# Altium schematic sheet FPGA_B14_B16.SchDoc: TE0722
size A4; Organization: Trenz Electronic GmbH; DocumentNumber: 3; Revision: 01; SheetNumber: 3; SheetTotal: 8; Date: 07.11.2014; PageSetup: Record=PageOptions|CenterHorizontal=True|CenterVertical=True|PrintScale=0.96|XCorrection=1.00|YCorrection=1.00|PrintKind=0|BorderSize=5000000|LeftOffset=0|BottomOffset=0|Orientation=2|PaperLength=1000|PaperWidth=1000|Scale=100|PaperSource=7|PrintQuality=-4|MediaType=1|DitherType=10|PaperKind=A4|PrintScaleMode=1
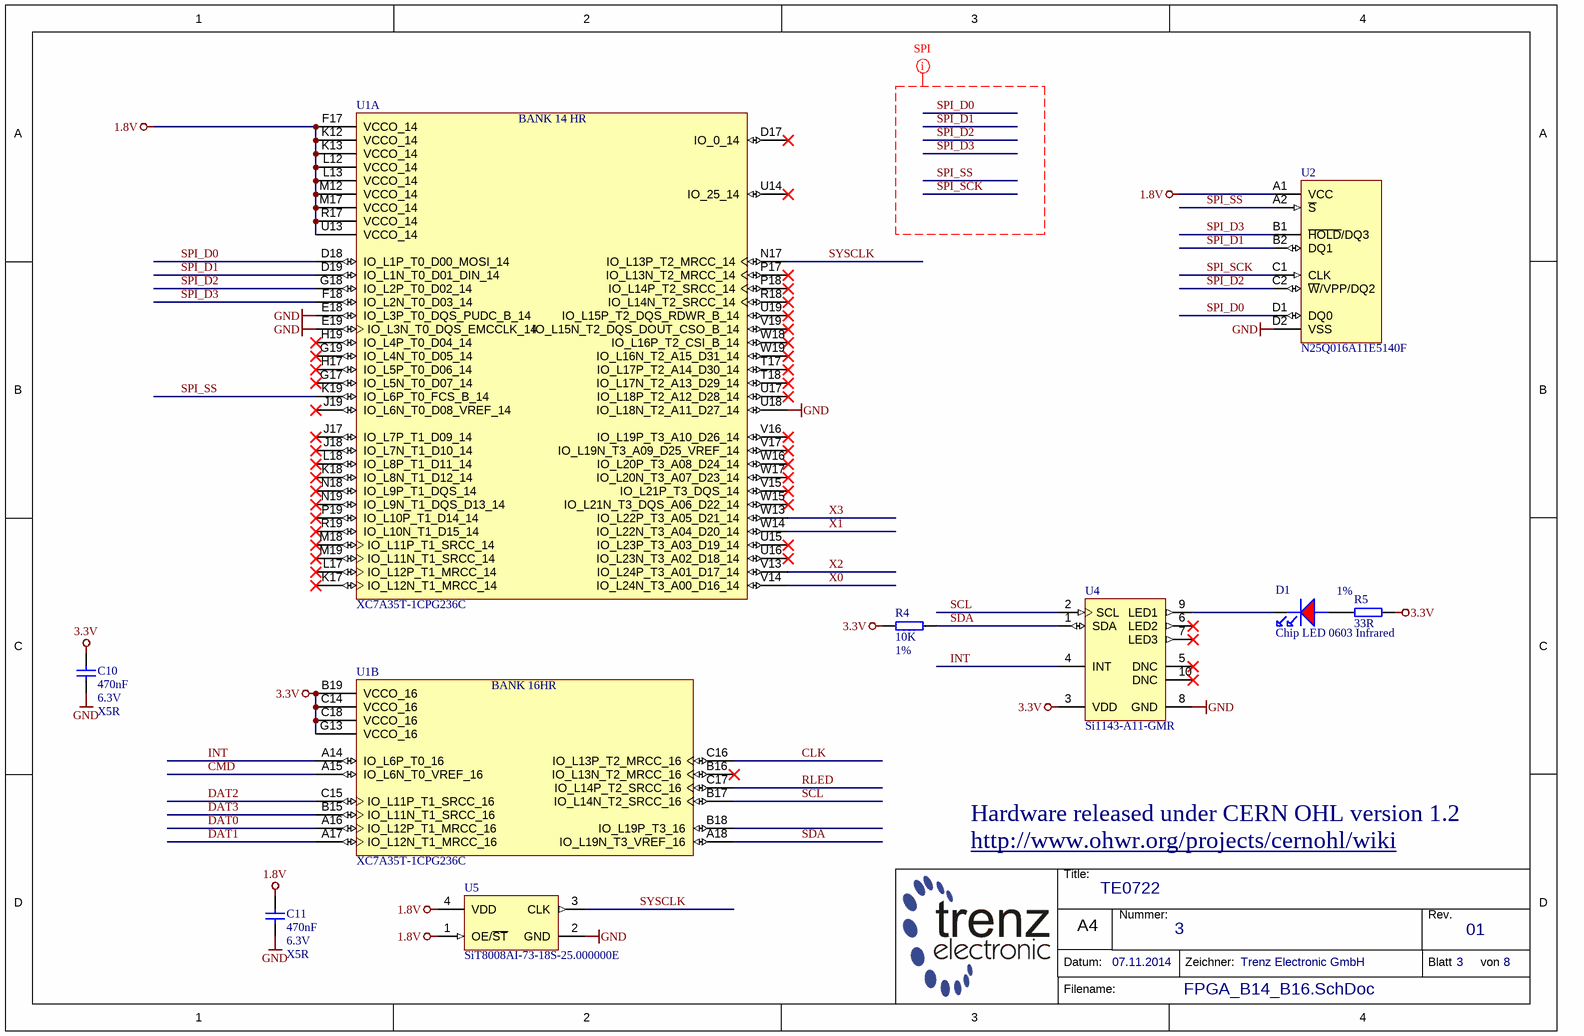
[diagram p0: FPGA_B14_B16.SchDoc]

## Parts
C10  470nF  Voltage: 6.3V  Technology: X5R  [CAPC0603X33N]
C11  470nF  Voltage: 6.3V  Technology: X5R  [CAPC0603X33N]
D1  Chip LED 0603 Infrared  [chipLED_0603_Red]
R4  10K  Tolerance: 1%  [RESC0603X26N]
R5  33R  Tolerance: 1%  [RESC1005X40N]
U1  XC7A35T-1CPG236C  [XC7AxxT-CPG236]  (parts A,B of 8)
U2  N25Q016A11E5140F  [BGA8C50P4X2_271X196X41B30N]
U4  Si1143-A11-GMR  [QFN50P200X200X75-10N]
U5  SiT8008AI-73-18S-25.000000E  [2016]

## Nets
1.8V: C11.1 U1.F17(VCCO_14) U1.K12(VCCO_14) U1.K13(VCCO_14) U1.L12(VCCO_14) U1.L13(VCCO_14) U1.M12(VCCO_14) U1.M17(VCCO_14) U1.R17(VCCO_14) U1.U13(VCCO_14) U2.A1(VCC) U5.1(OE/~{ST}) U5.4(VDD)
3.3V: C10.1 R4.1 R5.2 U1.B19(VCCO_16) U1.C14(VCCO_16) U1.C18(VCCO_16) U1.G13(VCCO_16) U4.3(VDD)
GND: C10.2 C11.2 U1.E18(IO_L3P_T0_DQS_PUDC_B_14) U1.E19(IO_L3N_T0_DQS_EMCCLK_14) U1.U18(IO_L18N_T2_A11_D27_14) U2.D2(VSS) U4.8(GND) U5.2(GND)
CLK: U1.C16(IO_L13P_T2_MRCC_16)
CMD: U1.A15(IO_L6N_T0_VREF_16)
DAT0: U1.A16(IO_L12P_T1_MRCC_16)
DAT1: U1.A17(IO_L12N_T1_MRCC_16)
DAT2: U1.C15(IO_L11P_T1_SRCC_16)
DAT3: U1.B15(IO_L11N_T1_SRCC_16)
INT: U1.A14(IO_L6P_T0_16) U4.4(INT)
RLED: U1.C17(IO_L14P_T2_SRCC_16)
SCL: U1.B17(IO_L14N_T2_SRCC_16) U4.2(SCL)
SDA: R4.2 U1.A18(IO_L19N_T3_VREF_16) U4.1(SDA)
SPI_D0: U1.D18(IO_L1P_T0_D00_MOSI_14) U2.D1(DQ0)
SPI_D1: U1.D19(IO_L1N_T0_D01_DIN_14) U2.B2(DQ1)
SPI_D2: U1.G18(IO_L2P_T0_D02_14) U2.C2(~{W}/VPP/DQ2)
SPI_D3: U1.F18(IO_L2N_T0_D03_14) U2.B1(~{HOLD}/DQ3)
SPI_SCK: U2.C1(CLK)
SPI_SS: U1.K19(IO_L6P_T0_FCS_B_14) U2.A2(~{S})
SYSCLK: U1.N17(IO_L13P_T2_MRCC_14) U5.3(CLK)
X0: U1.V14(IO_L24N_T3_A00_D16_14)
X1: U1.W14(IO_L22N_T3_A04_D20_14)
X2: U1.V13(IO_L24P_T3_A01_D17_14)
X3: U1.W13(IO_L22P_T3_A05_D21_14)
NetD1_A: D1.A R5.1
NetD1_K: D1.K U4.9(LED1)

Not connected (* = marked no-connect by the designer): U1 B16(IO_L13N_T2_MRCC_16)* B18(IO_L19P_T3_16) D17(IO_0_14)* G17(IO_L5N_T0_D07_14)* G19(IO_L4N_T0_D05_14)* H17(IO_L5P_T0_D06_14)* H19(IO_L4P_T0_D04_14)* J17(IO_L7P_T1_D09_14)* J18(IO_L7N_T1_D10_14)* J19(IO_L6N_T0_D08_VREF_14)* K17(IO_L12N_T1_MRCC_14)* K18(IO_L8N_T1_D12_14)* L17(IO_L12P_T1_MRCC_14)* L18(IO_L8P_T1_D11_14)* M18(IO_L11P_T1_SRCC_14)* M19(IO_L11N_T1_SRCC_14)* N18(IO_L9P_T1_DQS_14)* N19(IO_L9N_T1_DQS_D13_14)* P17(IO_L13N_T2_MRCC_14)* P18(IO_L14P_T2_SRCC_14)* P19(IO_L10P_T1_D14_14)* R18(IO_L14N_T2_SRCC_14)* R19(IO_L10N_T1_D15_14)* T17(IO_L17P_T2_A14_D30_14)* T18(IO_L17N_T2_A13_D29_14)* U14(IO_25_14)* U15(IO_L23P_T3_A03_D19_14)* U16(IO_L23N_T3_A02_D18_14)* U17(IO_L18P_T2_A12_D28_14)* U19(IO_L15P_T2_DQS_RDWR_B_14)* V15(IO_L21P_T3_DQS_14)* V16(IO_L19P_T3_A10_D26_14)* V17(IO_L19N_T3_A09_D25_VREF_14)* V19(IO_L15N_T2_DQS_DOUT_CSO_B_14)* W15(IO_L21N_T3_DQS_A06_D22_14)* W16(IO_L20P_T3_A08_D24_14)* W17(IO_L20N_T3_A07_D23_14)* W18(IO_L16P_T2_CSI_B_14)* W19(IO_L16N_T2_A15_D31_14)*; U4 5(DNC)* 6(LED2)* 7(LED3)* 10(DNC)*

## Layout directives
net class SPI: SPI_D0, SPI_D1, SPI_D2, SPI_D3, SPI_SCK, SPI_SS

## Notes on the sheet
- Hardware released under CERN OHL version 1.2
- http://www.ohwr.org/projects/cernohl/wiki
- Title:
- Nummer:
- Rev.
- Datum:
- A4
- Zeichner:
- Blatt
- von
- Filename:
- (in symbol 26752, part A) BANK 14 HR
- (in symbol 26752, part B) BANK 16HR

## Library data of the parts
C10 C11 = 24921: KON 470nF X5R 6.3V SMD 20%; AN: 24921; Mixed: SMT; Value: 470n; Preferred: Yes; Case: 0603 (0201); Tolerance: 20%
D1 = 26721: AN: 26721; Voltage: 1.2; Mixed: SMT; Preferred: Yes; Case: 0603; HelpURL: B:\AD\adlib\datasheet\APT1608F3C
R4 = 24914: WID SMD 10K 1% 0,05W; AN: 24914; Mixed: SMT; Preferred: Yes; Case: 0603 (0201); Value: 10K; HelpURL: B:\AD\adlib\datasheet\R0201
R5 = 22770: WID SMD 33R 1% 0,063W; AN: 22770; Mixed: SMT; Value: 33; Preferred: Yes; Case: 1005 (0402)
U1 = 26752: AN: 26752; Mixed: SMT; Trenz-Stock: Yes; Case: CPG236; HelpURL: B:\ad\adlib\datasheet\XC7
U2 = 26788: AN: 26788; Mixed: SMT; Trenz-Stock: Yes; Case: CSPBGA , XFBGA 8; HelpURL: B:\AD\adlib\datasheet\N25Q016A11E; Preferred: Yes
U4 = 26318: AN: 26318; Mixed: AMT; Case: QFN10; HelpURL: B:\AD\adlib\datasheet\Si1141x
U5 = 26674: SiT8008AI-73-18S-25.000000E MEMS Oszillator 25MHz; AN: 26674; Voltage: 1.8V; Mixed: SMT; Trenz-Stock: Yes; Value: 25M; Case: 2.0  x 1.6mm; HelpURL: B:\AD\adlib\datasheet\SiT8008; Preferred: Yes